# EAGLE schematic Power_supply (EAGLE 7.5.0)
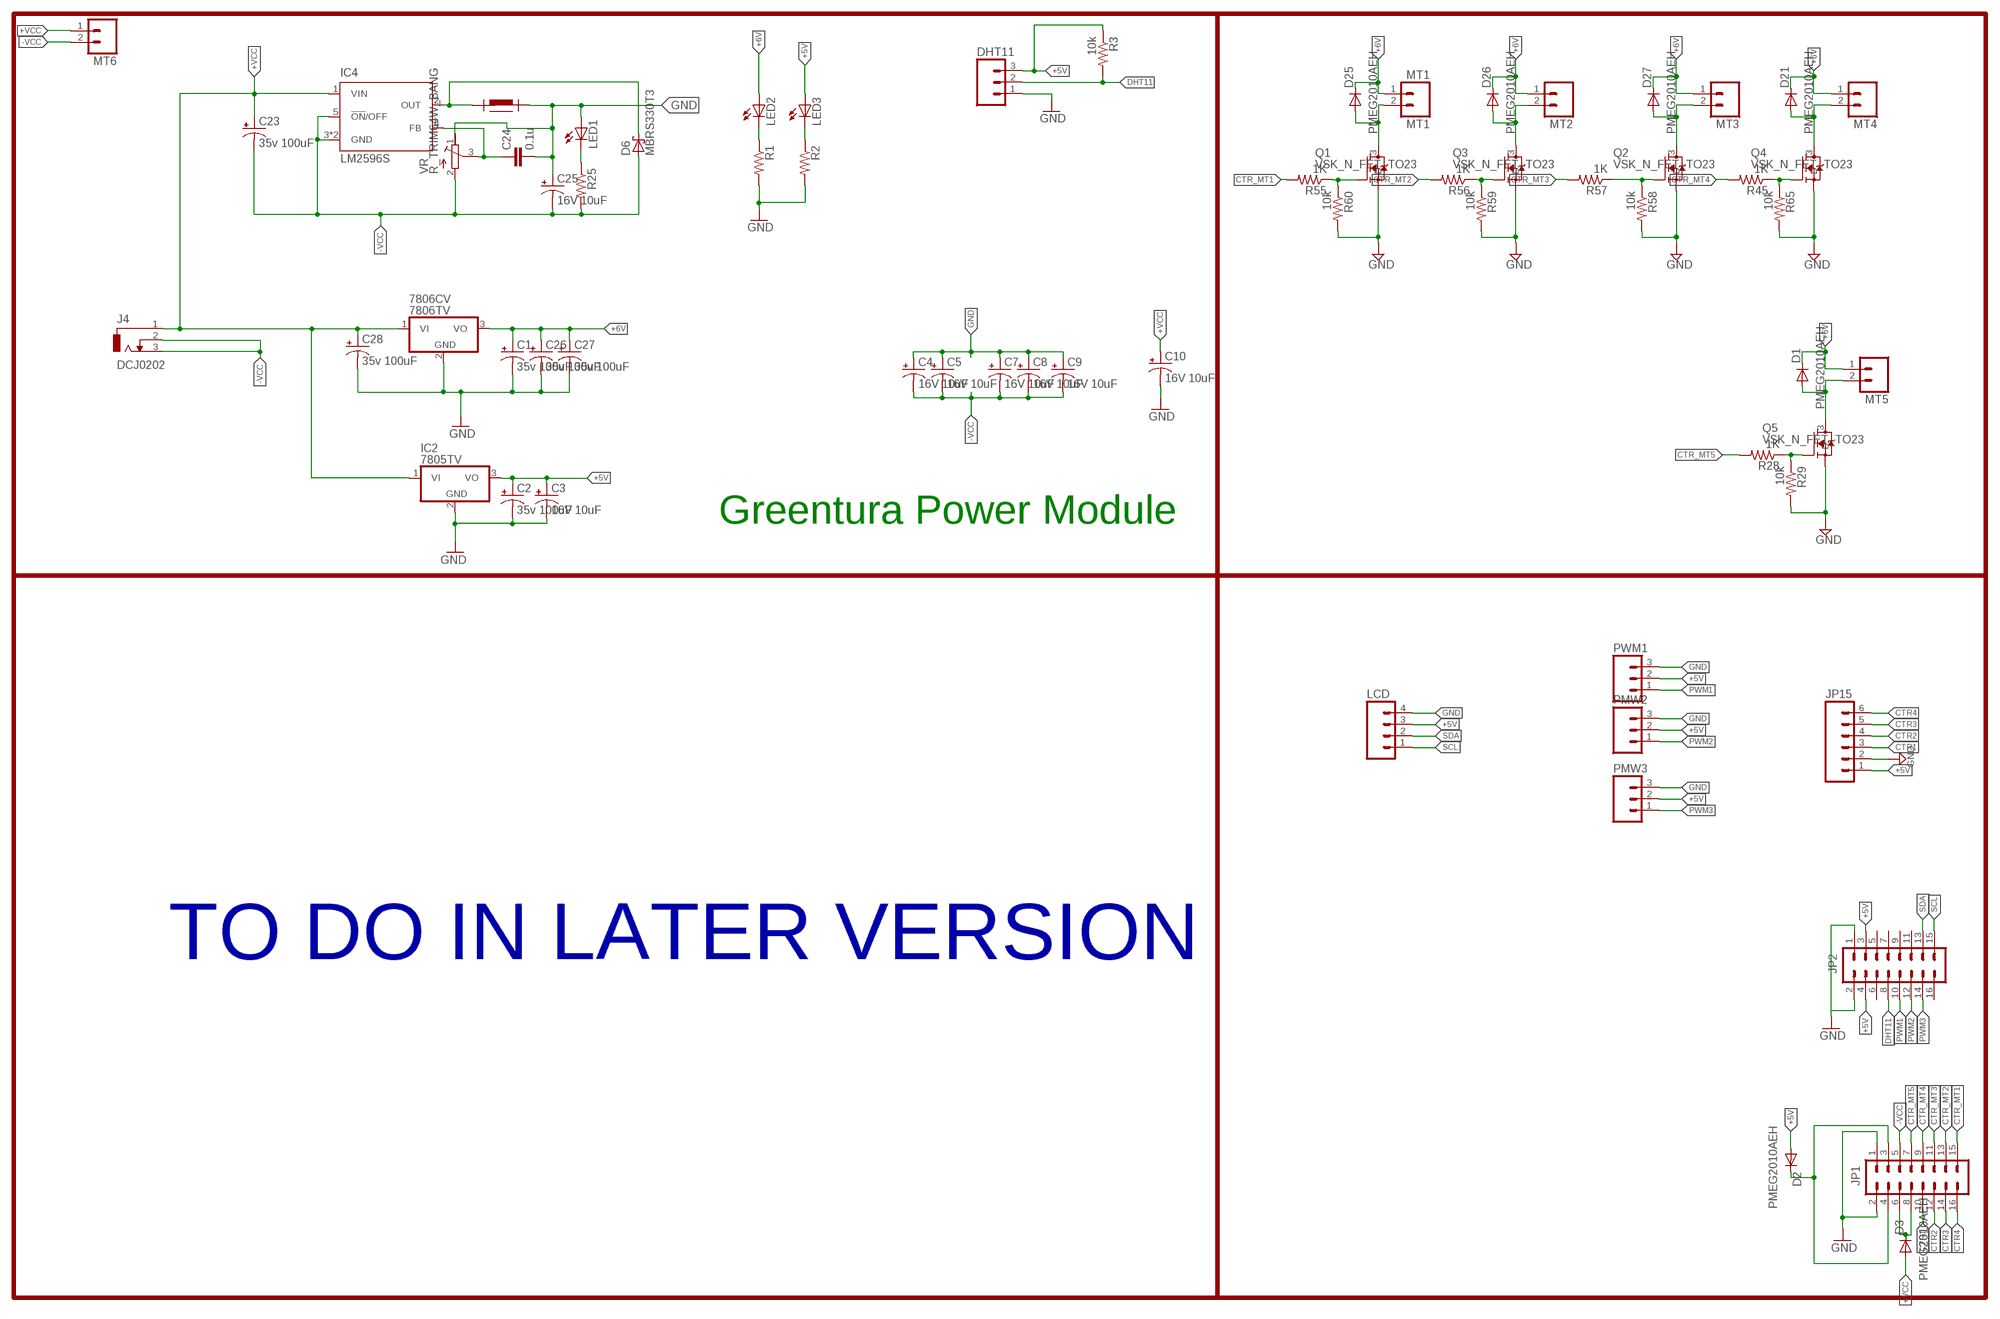
[diagram p0: schematic, sheet 1]

## Parts
7806CV  7806TV  7805TV  [TO220V]
C1  35v 100uF  CPOL-USTT5D9  [TT5D9]
C2  35v 100uF  CPOL-USUD-8X10  [UD-8X10_NICHICON]
C3  16V 10uF  CPOL-USSMCD  [SMC_D]
C4  16V 10uF  CPOL-USTT2D6  [TT2D6]
C5  16V 10uF  CPOL-USTT2D6  [TT2D6]
C7  16V 10uF  CPOL-USTT2D6  [TT2D6]
C8  16V 10uF  CPOL-USTT2D6  [TT2D6]
C9  16V 10uF  CPOL-USTT2D6  [TT2D6]
C10  16V 10uF  CPOL-USUD-6,3X7,7  [UD-6,3X7,7_NICHICON]
C23  35v 100uF  CPOL-USUD-6,3X7,7  [UD-6,3X7,7_NICHICON]
C24  0.1u  SPARKFUN_CAP0603-CAP  [SPARKFUN_0603-CAP]
C25  16V 10uF  CPOL-USUD-8X10  [UD-8X10_NICHICON]
C26  35v 100uF  CPOL-USTT5D9  [TT5D9]
C27  35v 100uF  CPOL-USTT5D9  [TT5D9]
C28  35v 100uF  CPOL-USSMCC  [SMC_C]
D1  PMEG2010AEH  DIOD_SOT123F  [SOT123F]
D2  PMEG2010AEH  DIOD_SOT123F  [SOT123F]
D3  PMEG2010AEH  DIOD_SOT123F  [SOT123F]
D6  MBRS330T3  [SMC]
D21  PMEG2010AEH  DIOD_SOT123F  [SOT123F]
D25  PMEG2010AEH  DIOD_SOT123F  [SOT123F]
D26  PMEG2010AEH  DIOD_SOT123F  [SOT123F]
D27  PMEG2010AEH  DIOD_SOT123F  [SOT123F]
DHT11  M03PTH  [1X03]
IC2  7805TV  [TO220V]
IC4  LM2596S  [TO263-5]
J4  DCJ0202  [DCJ0202]
JP1  M08X2  [2X8]
JP2  M08X2  [2X8]
JP15  M06POLAR  [MOLEX-1X6]
LCD  M04PTH  [1X04]
LED1  SPARKFUN_LED0603  [SPARKFUN_LED-0603]
LED2  SPARKFUN_LED0603  [SPARKFUN_LED-0603]
LED3  SPARKFUN_LED0603  [SPARKFUN_LED-0603]
MT1  MT1  M02POLAR  [MOLEX-1X2]
MT2  M02POLAR  [MOLEX-1X2]
MT3  M02POLAR  [MOLEX-1X2]
MT4  M02POLAR  [MOLEX-1X2]
MT5  M02POLAR  [MOLEX-1X2]
MT6  M025MM  [SCREWTERMINAL-5MM-2]
PMW2  M03PTH  [1X03]
PMW3  M03PTH  [1X03]
PWM1  M03PTH  [1X03]
Q1  VSK_N_FET_TO23  [SOT23]
Q2  VSK_N_FET_TO23  [SOT23]
Q3  VSK_N_FET_TO23  [SOT23]
Q4  VSK_N_FET_TO23  [SOT23]
Q5  VSK_N_FET_TO23  [SOT23]
R1  SPARKFUN_RESISTOR0805-RES  [SPARKFUN_0805]
R2  SPARKFUN_RESISTOR0805-RES  [SPARKFUN_0805]
R3  10k  R-US_R0603  [R0603]
R25  SPARKFUN_RESISTOR0805-RES  [SPARKFUN_0805]
R28  1K  R-US_R0603  [R0603]
R29  10k  R-US_R0603  [R0603]
R45  1K  R-US_R0603  [R0603]
R55  1K  R-US_R0603  [R0603]
R56  1K  R-US_R0603  [R0603]
R57  1K  R-US_R0603  [R0603]
R58  10k  R-US_R0603  [R0603]
R59  10k  R-US_R0603  [R0603]
R60  10k  R-US_R0603  [R0603]
R65  10k  R-US_R0603  [R0603]
U$2  BIG_INDUCTOR  [12X12]
VR  R_TRIM64W_BANG  [RTRIM64W_BANG]

## Nets
+5V [power]: C2.+ C3.+ D2.A DHT11.3 IC2.3(VO) JP2.3 JP2.4 JP15.1 LCD.3 LED3.A PMW2.2 PMW3.2 PWM1.2 R3.1
+6V: 7806CV.3(VO) C1.+ C26.+ C27.+ D1.C D21.C D25.C D26.C D27.C LED2.A MT1.1 MT2.1 MT3.1 MT4.1 MT5.1
+VCC: 7806CV.1(VI) C10.+ C23.+ C28.+ D3.A IC2.1(VI) IC4.1(VIN) J4.1 MT6.1
-VCC: C4.- C5.- C7.- C8.- C9.- C23.- C25.- D6.A IC4.3(GND) IC4.5(!ON!/OFF) IC4.6(GND) J4.2 J4.3 JP1.5 MT6.2 R25.2 VR.2(E)
CTR1: JP1.10 JP15.3
CTR2: JP1.12 JP15.4
CTR3: JP1.14 JP15.5
CTR4: JP1.16 JP15.6
CTR_MT1: JP1.15 R55.2
CTR_MT2: JP1.13 R56.2
CTR_MT3: JP1.11 R57.2
CTR_MT4: JP1.9 R45.2
CTR_MT5: JP1.7 R28.2
DHT11: DHT11.2 JP2.8 R3.2
GND: 7806CV.2(GND) C1.- C2.- C3.- C4.+ C5.+ C7.+ C8.+ C9.+ C10.- C24.2 C25.+ C26.- C27.- C28.- DHT11.1 IC2.2(GND) JP1.1 JP1.2 JP2.1 JP2.2 JP15.2 LCD.4 LED1.A PMW2.3 PMW3.3 PWM1.3 Q1.2(S) Q2.2(S) Q3.2(S) Q4.2(S) Q5.2(S) R1.2 R2.2 R29.2 R58.2 R59.2 R60.2 R65.2 U$2.P$1 VR.1(A)
N: D3.C JP1.6 JP1.8
N$1: D2.C JP1.3 JP1.4
N$2: C24.1 IC4.4(FB) VR.3(S)
N$4: LED2.C R1.1
N$5: LED3.C R2.1
N$16: LED1.C R25.1
N$18: D27.A MT3.2 Q2.3(D)
N$19: D25.A MT1.2 Q1.3(D)
N$20: D1.A MT5.2 Q5.3(D)
N$26: Q5.1(G) R28.1 R29.1
N$55: D26.A MT2.2 Q3.3(D)
N$58: Q2.1(G) R57.1 R58.1
N$59: Q3.1(G) R56.1 R59.1
N$60: D21.A MT4.2 Q4.3(D)
N$61: Q1.1(G) R55.1 R60.1
N$65: Q4.1(G) R45.1 R65.1
OUT1: D6.C IC4.2(OUT) U$2.P$2
PWM1: JP2.10 PWM1.1
PWM2: JP2.12 PMW2.1
PWM3: JP2.14 PMW3.1
SCL: JP2.15 LCD.1
SDA: JP2.13 LCD.2
Unconnected: JP2.5 JP2.6 JP2.7 JP2.9 JP2.11 JP2.16

## Notes on the sheet
- Greentura Power Module
- TO DO IN LATER VERSION

## Library data of the parts
7806CV IC2 = linear:78*: Positive VOLTAGE REGULATOR Source: http://cache.national.com/ds/LM/LM78L05.pdf http://www.fairchildsemi.com/ds/LM/LM7805.pdf
C1-C5 C7-C10 C23 C25-C28 = rcl:CPOL-US: POLARIZED CAPACITOR, American symbol
C24 = Robotech_RCL:SPARKFUN_CAP: Capacitor Standard 0603 ceramic capacitor, and 0.1" leaded capacitor.
D1-D3 D21 D25-D27 = Enleka_Diode:DIOD_SOT123F; PARTNO: PMEG2010AEH,115
D6 = Robotech Diode of Chung:MBRS3*0T3: SCHOTTKY BARRIER RECTIFIER 3.0 AMPERES 20, 30, 40 VOLT Source: MBRS340T3-D.pdf
DHT11 PMW2 PMW3 PWM1 = SparkFun-Connectors:M03: Header 3 Standard 3-pin 0.1" header. Use with straight break away headers (SKU : PRT-00116), right angle break away headers (PRT-00553), swiss pins (PRT-00743), machine pins (PRT-00117), and female headers (PRT-00115). Molex polarized connector foot print use with SKU : PRT-08232 with associated crimp pins and housings.
IC4 = national-semiconductor:LM2596: SIMPLE SWITCHER® Power Converter 150 kHz 3A Step-Down Voltage Regulator Source: http://www.national.com/ds/LM/LM2596.pdf; MF: NATIONAL SEMICONDUCTOR; MPN: LM2596S-ADJ/NOPB; OC_FARNELL: 9494367; OC_NEWARK: 41K3842
J4 = con-jack:DCJ0202: DC POWER JACK Source: DCJ0202.pdf; OC_FARNELL: unknown; OC_NEWARK: unknown
JP1 JP2 = SparkFun-Connectors:M08X2: .1" headers, two rows of 8 each
JP15 = SparkFun-Connectors:M06: Header 6 Standard 6-pin 0.1" header. Use with straight break away headers (SKU : PRT-00116), right angle break away headers (PRT-00553), swiss pins (PRT-00743), machine pins (PRT-00117), and female headers (PRT-00115). Molex polarized connector foot print use with SKU : PRT-08094 with associated crimp pins and housings. NOTES ON THE VARIANTS LOCK and LOCK_LONGPADS... This footprint was designed to help hold the alignment of a through-hole component (i.e. 6-pin header) while soldering it into place. You may notice that each hole has been shifted either up or down by 0.005 of an inch from it's more standard position (which is a perfectly straight line). This slight alteration caused the pins (the squares in the middle) to touch the edges of the holes. Because they are alternating, it causes a "brace" to hold the component in place. 0.005 has proven to be the perfect amount of "off-center" position when using our standard breakaway headers. Although looks a little odd when you look at the bare footprint, once you have a header in there, the alteration is very hard to notice. Also,if you push a header all the way into place, it is covered up entirely on the bottom side. This idea of altering the position of holes to aid alignment will be further integrated into the Sparkfun Library for other footprints. It can help hold any component with 3 or more connection pins.
LCD = SparkFun-Connectors:M04: Header 4 Standard 4-pin 0.1" header. Use with straight break away headers (SKU : PRT-00116), right angle break away headers (PRT-00553), swiss pins (PRT-00743), machine pins (PRT-00117), and female headers (PRT-00115). Molex polarized connector foot print use with SKU : PRT-08231 with associated crimp pins and housings. 1MM SMD Version SKU: PRT-10208
LED1-LED3 = Robotech RLC of Chung:SPARKFUN_LED: LEDs Standard schematic elements and footprints for 5mm, 3mm, 1206, and 0603 sized LEDs. 5mm - Spark Fun Electronics SKU : COM-00529 (and others)
MT1-MT5 = SparkFun-Connectors:M02: Standard 2-pin 0.1" header. Use with - straight break away headers ( PRT-00116) - right angle break away headers (PRT-00553) - swiss pins (PRT-00743) - machine pins (PRT-00117) - female headers (PRT-00115) Molex polarized connector foot print use with: PRT-08233 with associated crimp pins and housings. 2.54_SCREWTERM for use with PRT-10571. 3.5mm Screw Terminal footprints for PRT-08084 5mm Screw Terminal footprints for use with PRT-08432
MT6 = SparkFun-Connectors:M02: Standard 2-pin 0.1" header. Use with - straight break away headers ( PRT-00116) - right angle break away headers (PRT-00553) - swiss pins (PRT-00743) - machine pins (PRT-00117) - female headers (PRT-00115) Molex polarized connector foot print use with: PRT-08233 with associated crimp pins and housings. 2.54_SCREWTERM for use with PRT-10571. 3.5mm Screw Terminal footprints for PRT-08084 5mm Screw Terminal footprints for use with PRT-08432; STOREFRONT_ID: PRT-08432
Q1-Q5 = transistor-fet:VSK_N_FET_TO23
R1 R2 R25 = Robotech_RCL:SPARKFUN_RESISTOR: Resistor Basic schematic elements and footprints for 0603, 1206, and PTH resistors.
R3 R28 R29 R45 R55-R60 R65 = resistor:R-US_: RESISTOR, American symbol
U$2 = Big_inductor:BIG_INDUCTOR
VR = rtrim:R_TRIM64W_BANG

## Net classes
1 power: width 0.15 mm, drill 0.2 mm, clearance 0.152 mm